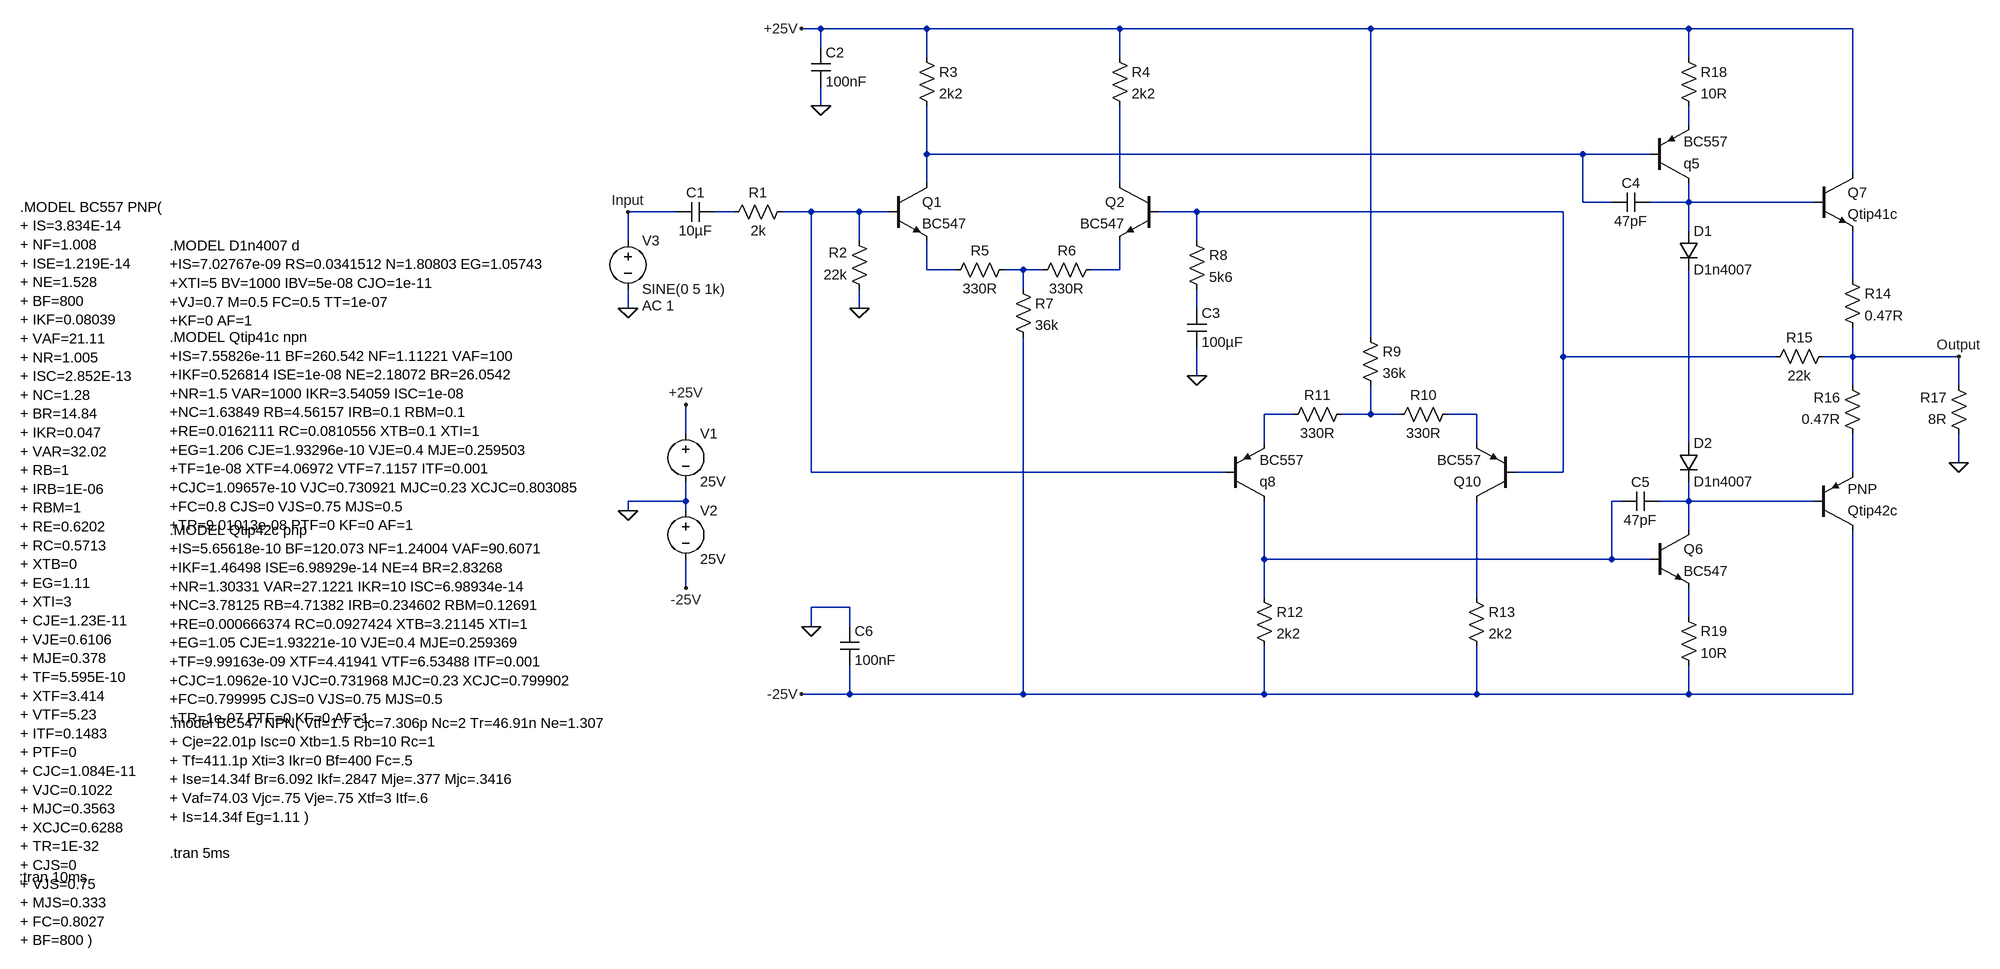
[diagram p0: schematic simulacao - AmplificadorAB.asc]
simulacao - AmplificadorAB.asc, the LTspice schematic file:
Version 4
SHEET 1 2872 1376
WIRE 192 -112 160 -112
WIRE 368 -112 192 -112
WIRE 688 -112 368 -112
WIRE 1104 -112 688 -112
WIRE 1632 -112 1104 -112
WIRE 1904 -112 1632 -112
WIRE 192 -80 192 -112
WIRE 368 -64 368 -112
WIRE 688 -64 688 -112
WIRE 1632 -64 1632 -112
WIRE 192 16 192 -16
WIRE 1632 48 1632 16
WIRE 368 96 368 16
WIRE 1456 96 368 96
WIRE 1568 96 1456 96
WIRE 1904 128 1904 -112
WIRE 368 144 368 96
WIRE 688 144 688 16
WIRE 1456 176 1456 96
WIRE 1504 176 1456 176
WIRE 1632 176 1632 144
WIRE 1632 176 1568 176
WIRE 1840 176 1632 176
WIRE -48 192 -128 192
WIRE 48 192 16 192
WIRE 176 192 128 192
WIRE 256 192 176 192
WIRE 304 192 256 192
WIRE 816 192 752 192
WIRE 1424 192 816 192
WIRE 1632 224 1632 176
WIRE -128 240 -128 192
WIRE 256 240 256 192
WIRE 816 240 816 192
WIRE 368 288 368 240
WIRE 416 288 368 288
WIRE 528 288 496 288
WIRE 560 288 528 288
WIRE 688 288 688 240
WIRE 688 288 640 288
WIRE 1904 304 1904 224
WIRE 528 320 528 288
WIRE -128 352 -128 320
WIRE 256 352 256 320
WIRE 816 352 816 320
WIRE 1104 400 1104 -112
WIRE 1424 432 1424 192
WIRE 1776 432 1424 432
WIRE 1904 432 1904 384
WIRE 1904 432 1856 432
WIRE 2080 432 1904 432
WIRE 816 464 816 416
WIRE 1904 480 1904 432
WIRE 2080 480 2080 432
WIRE 976 528 928 528
WIRE 1104 528 1104 480
WIRE 1104 528 1056 528
WIRE 1152 528 1104 528
WIRE 1280 528 1232 528
WIRE -32 560 -32 512
WIRE 928 576 928 528
WIRE 1280 576 1280 528
WIRE 1632 576 1632 288
WIRE 2080 608 2080 560
WIRE 176 624 176 192
WIRE 864 624 176 624
WIRE 1424 624 1424 432
WIRE 1424 624 1344 624
WIRE 1904 624 1904 560
WIRE -32 672 -32 640
WIRE -32 672 -128 672
WIRE 1520 672 1504 672
WIRE 1632 672 1632 640
WIRE 1632 672 1584 672
WIRE 1840 672 1632 672
WIRE -128 688 -128 672
WIRE -32 688 -32 672
WIRE 1632 720 1632 672
WIRE 928 768 928 672
WIRE 1504 768 1504 672
WIRE 1504 768 928 768
WIRE 1568 768 1504 768
WIRE -32 816 -32 768
WIRE 928 832 928 768
WIRE 1280 832 1280 672
WIRE 240 848 176 848
WIRE 1632 864 1632 816
WIRE 176 880 176 848
WIRE 240 880 240 848
WIRE 240 992 240 944
WIRE 240 992 160 992
WIRE 528 992 528 400
WIRE 528 992 240 992
WIRE 928 992 928 912
WIRE 928 992 528 992
WIRE 1280 992 1280 912
WIRE 1280 992 928 992
WIRE 1632 992 1632 944
WIRE 1632 992 1280 992
WIRE 1904 992 1904 720
WIRE 1904 992 1632 992
FLAG 256 352 0
FLAG 816 464 0
FLAG 2080 608 0
FLAG -128 688 0
FLAG -32 512 +25V
FLAG -32 816 -25V
FLAG 160 -112 +25V
FLAG 192 16 0
FLAG 160 992 -25V
FLAG -128 352 0
FLAG 176 880 0
FLAG 2080 432 Output
FLAG -128 192 Input
SYMBOL cap 16 176 R90
WINDOW 0 0 32 VBottom 2
WINDOW 3 32 32 VTop 2
SYMATTR InstName C1
SYMATTR Value 10µF
SYMBOL res 144 176 R90
WINDOW 0 0 56 VBottom 2
WINDOW 3 32 56 VTop 2
SYMATTR InstName R1
SYMATTR Value 2k
SYMBOL res 272 336 R180
WINDOW 0 36 76 Left 2
WINDOW 3 36 40 Left 2
SYMATTR InstName R2
SYMATTR Value 22k
SYMBOL cap 176 -80 R0
SYMATTR InstName C2
SYMATTR Value 100nF
SYMBOL res 352 -80 R0
SYMATTR InstName R3
SYMATTR Value 2k2
SYMBOL res 672 -80 R0
SYMATTR InstName R4
SYMATTR Value 2k2
SYMBOL res 512 272 R90
WINDOW 0 0 56 VBottom 2
WINDOW 3 32 56 VTop 2
SYMATTR InstName R5
SYMATTR Value 330R
SYMBOL res 656 272 R90
WINDOW 0 0 56 VBottom 2
WINDOW 3 32 56 VTop 2
SYMATTR InstName R6
SYMATTR Value 330R
SYMBOL res 512 304 R0
SYMATTR InstName R7
SYMATTR Value 36k
SYMBOL res 800 224 R0
SYMATTR InstName R8
SYMATTR Value 5k6
SYMBOL cap 800 352 R0
SYMATTR InstName C3
SYMATTR Value 100µF
SYMBOL npn 304 144 R0
SYMATTR InstName Q1
SYMATTR Value BC547
SYMBOL npn 752 144 M0
SYMATTR InstName Q2
SYMATTR Value BC547
SYMBOL pnp 864 672 M180
SYMATTR InstName q8
SYMATTR Value BC557
SYMBOL pnp 1344 672 R180
SYMATTR InstName Q10
SYMATTR Value BC557
SYMBOL res 1088 384 R0
SYMATTR InstName R9
SYMATTR Value 36k
SYMBOL res 1248 512 R90
WINDOW 0 0 56 VBottom 2
WINDOW 3 32 56 VTop 2
SYMATTR InstName R10
SYMATTR Value 330R
SYMBOL res 1072 512 R90
WINDOW 0 0 56 VBottom 2
WINDOW 3 32 56 VTop 2
SYMATTR InstName R11
SYMATTR Value 330R
SYMBOL res 912 816 R0
SYMATTR InstName R12
SYMATTR Value 2k2
SYMBOL res 1264 816 R0
SYMATTR InstName R13
SYMATTR Value 2k2
SYMBOL res 1888 288 R0
SYMATTR InstName R14
SYMATTR Value 0.47R
SYMATTR SpiceLine pwr=5W
SYMBOL res 1872 416 R90
WINDOW 0 0 56 VBottom 2
WINDOW 3 32 56 VTop 2
SYMATTR InstName R15
SYMATTR Value 22k
SYMBOL res 1920 576 R180
WINDOW 0 36 76 Left 2
WINDOW 3 36 40 Left 2
SYMATTR InstName R16
SYMATTR Value 0.47R
SYMATTR SpiceLine pwr=5W
SYMBOL res 2096 576 R180
WINDOW 0 36 76 Left 2
WINDOW 3 36 40 Left 2
SYMATTR InstName R17
SYMATTR Value 8R
SYMATTR SpiceLine pwr=50W
SYMBOL voltage -32 544 R0
WINDOW 123 0 0 Left 0
WINDOW 39 0 0 Left 0
SYMATTR InstName V1
SYMATTR Value 25V
SYMBOL voltage -32 672 R0
WINDOW 123 0 0 Left 0
WINDOW 39 0 0 Left 0
SYMATTR InstName V2
SYMATTR Value 25V
SYMBOL pnp 1568 144 M180
SYMATTR InstName q5
SYMATTR Value BC557
SYMBOL res 1616 -80 R0
SYMATTR InstName R18
SYMATTR Value 10R
SYMBOL cap 1568 160 R90
WINDOW 0 0 32 VBottom 2
WINDOW 3 32 32 VTop 2
SYMATTR InstName C4
SYMATTR Value 47pF
SYMBOL diode 1616 224 R0
SYMATTR InstName D1
SYMATTR Value D1n4007
SYMBOL npn 1568 720 R0
SYMATTR InstName Q6
SYMATTR Value BC547
SYMBOL diode 1616 576 R0
SYMATTR InstName D2
SYMATTR Value D1n4007
SYMBOL cap 1584 656 R90
WINDOW 0 0 32 VBottom 2
WINDOW 3 32 32 VTop 2
SYMATTR InstName C5
SYMATTR Value 47pF
SYMBOL res 1616 848 R0
SYMATTR InstName R19
SYMATTR Value 10R
SYMBOL npn 1840 128 R0
SYMATTR InstName Q7
SYMATTR Value Qtip41c
SYMBOL pnp 1840 720 M180
SYMATTR InstName Qtip42c
SYMBOL voltage -128 224 R0
WINDOW 123 24 124 Left 2
WINDOW 39 0 0 Left 0
SYMATTR Value2 AC 1
SYMATTR InstName V3
SYMATTR Value SINE(0 5 1k)
SYMBOL cap 224 880 R0
SYMATTR InstName C6
SYMATTR Value 100nF
TEXT -888 248 Left 2 !.MODEL D1n4007 d\n+IS=7.02767e-09 RS=0.0341512 N=1.80803 EG=1.05743\n+XTI=5 BV=1000 IBV=5e-08 CJO=1e-11\n+VJ=0.7 M=0.5 FC=0.5 TT=1e-07\n+KF=0 AF=1
TEXT -888 400 Left 2 !.MODEL Qtip41c npn\n+IS=7.55826e-11 BF=260.542 NF=1.11221 VAF=100\n+IKF=0.526814 ISE=1e-08 NE=2.18072 BR=26.0542\n+NR=1.5 VAR=1000 IKR=3.54059 ISC=1e-08\n+NC=1.63849 RB=4.56157 IRB=0.1 RBM=0.1\n+RE=0.0162111 RC=0.0810556 XTB=0.1 XTI=1\n+EG=1.206 CJE=1.93296e-10 VJE=0.4 MJE=0.259503\n+TF=1e-08 XTF=4.06972 VTF=7.1157 ITF=0.001\n+CJC=1.09657e-10 VJC=0.730921 MJC=0.23 XCJC=0.803085\n+FC=0.8 CJS=0 VJS=0.75 MJS=0.5\n+TR=9.01013e-08 PTF=0 KF=0 AF=1
TEXT -888 720 Left 2 !.MODEL Qtip42c pnp\n+IS=5.65618e-10 BF=120.073 NF=1.24004 VAF=90.6071\n+IKF=1.46498 ISE=6.98929e-14 NE=4 BR=2.83268\n+NR=1.30331 VAR=27.1221 IKR=10 ISC=6.98934e-14\n+NC=3.78125 RB=4.71382 IRB=0.234602 RBM=0.12691\n+RE=0.000666374 RC=0.0927424 XTB=3.21145 XTI=1\n+EG=1.05 CJE=1.93221e-10 VJE=0.4 MJE=0.259369\n+TF=9.99163e-09 XTF=4.41941 VTF=6.53488 ITF=0.001\n+CJC=1.0962e-10 VJC=0.731968 MJC=0.23 XCJC=0.799902\n+FC=0.799995 CJS=0 VJS=0.75 MJS=0.5\n+TR=1e-07 PTF=0 KF=0 AF=1
TEXT -888 1040 Left 2 !.model BC547 NPN( Vtf=1.7 Cjc=7.306p Nc=2 Tr=46.91n Ne=1.307 \n+ Cje=22.01p Isc=0 Xtb=1.5 Rb=10 Rc=1 \n+ Tf=411.1p Xti=3 Ikr=0 Bf=400 Fc=.5 \n+ Ise=14.34f Br=6.092 Ikf=.2847 Mje=.377 Mjc=.3416 \n+ Vaf=74.03 Vjc=.75 Vje=.75 Xtf=3 Itf=.6 \n+ Is=14.34f Eg=1.11 )
TEXT -1136 184 Left 2 !.MODEL BC557 PNP(\n+ IS=3.834E-14\n+ NF=1.008\n+ ISE=1.219E-14\n+ NE=1.528\n+ BF=800\n+ IKF=0.08039\n+ VAF=21.11\n+ NR=1.005\n+ ISC=2.852E-13\n+ NC=1.28\n+ BR=14.84\n+ IKR=0.047\n+ VAR=32.02\n+ RB=1\n+ IRB=1E-06\n+ RBM=1\n+ RE=0.6202\n+ RC=0.5713\n+ XTB=0\n+ EG=1.11\n+ XTI=3\n+ CJE=1.23E-11\n+ VJE=0.6106\n+ MJE=0.378\n+ TF=5.595E-10\n+ XTF=3.414\n+ VTF=5.23\n+ ITF=0.1483\n+ PTF=0\n+ CJC=1.084E-11\n+ VJC=0.1022\n+ MJC=0.3563\n+ XCJC=0.6288\n+ TR=1E-32\n+ CJS=0\n+ VJS=0.75\n+ MJS=0.333\n+ FC=0.8027\n+ BF=800 )
TEXT -888 1256 Left 2 !.tran 5ms
TEXT -1138 1296 Left 2 !;tran 10ms

The netlist it stands for:
* simulacao - AmplificadorAB.asc
C1 N005 Input 10µF
R1 N006 N005 2k
R2 0 N006 22k
C2 +25V 0 100nF
R3 +25V N002 2k2
R4 +25V N003 2k2
R5 N009 N008 330R
R6 N010 N009 330R
R7 N009 -25V 36k
R8 N007 N012 5k6
C3 N012 0 100µF
Q1 N002 N006 N008 0 BC547
Q2 N003 N007 N010 0 BC547
q8 N018 N006 N013 0 BC557
Q10 N020 N007 N015 0 BC557
R9 +25V N014 36k
R10 N015 N014 330R
R11 N014 N013 330R
R12 N018 -25V 2k2
R13 N020 -25V 2k2
R14 N011 Output 0.47R pwr=5W
R15 Output N007 22k
R16 N017 Output 0.47R pwr=5W
R17 0 Output 8R pwr=50W
V1 +25V 0 25V
V2 0 -25V 25V
q5 N004 N002 N001 0 BC557
R18 +25V N001 10R
C4 N004 N002 47pF
D1 N004 N016 D1n4007
Q6 N019 N018 N021 0 BC547
D2 N016 N019 D1n4007
C5 N019 N018 47pF
R19 N021 -25V 10R
Q7 +25V N004 N011 0 Qtip41c
Qtip42c -25V N019 N017 0 PNP
V3 Input 0 SINE(0 5 1k) AC 1
C6 0 -25V 100nF
.model D D
.lib standard.dio
.model NPN NPN
.model PNP PNP
.lib standard.bjt
.MODEL D1n4007 d
+IS=7.02767e-09 RS=0.0341512 N=1.80803 EG=1.05743
+XTI=5 BV=1000 IBV=5e-08 CJO=1e-11
+VJ=0.7 M=0.5 FC=0.5 TT=1e-07
+KF=0 AF=1
.MODEL Qtip41c npn
+IS=7.55826e-11 BF=260.542 NF=1.11221 VAF=100
+IKF=0.526814 ISE=1e-08 NE=2.18072 BR=26.0542
+NR=1.5 VAR=1000 IKR=3.54059 ISC=1e-08
+NC=1.63849 RB=4.56157 IRB=0.1 RBM=0.1
+RE=0.0162111 RC=0.0810556 XTB=0.1 XTI=1
+EG=1.206 CJE=1.93296e-10 VJE=0.4 MJE=0.259503
+TF=1e-08 XTF=4.06972 VTF=7.1157 ITF=0.001
+CJC=1.09657e-10 VJC=0.730921 MJC=0.23 XCJC=0.803085
+FC=0.8 CJS=0 VJS=0.75 MJS=0.5
+TR=9.01013e-08 PTF=0 KF=0 AF=1
.MODEL Qtip42c pnp
+IS=5.65618e-10 BF=120.073 NF=1.24004 VAF=90.6071
+IKF=1.46498 ISE=6.98929e-14 NE=4 BR=2.83268
+NR=1.30331 VAR=27.1221 IKR=10 ISC=6.98934e-14
+NC=3.78125 RB=4.71382 IRB=0.234602 RBM=0.12691
+RE=0.000666374 RC=0.0927424 XTB=3.21145 XTI=1
+EG=1.05 CJE=1.93221e-10 VJE=0.4 MJE=0.259369
+TF=9.99163e-09 XTF=4.41941 VTF=6.53488 ITF=0.001
+CJC=1.0962e-10 VJC=0.731968 MJC=0.23 XCJC=0.799902
+FC=0.799995 CJS=0 VJS=0.75 MJS=0.5
+TR=1e-07 PTF=0 KF=0 AF=1
.model BC547 NPN( Vtf=1.7 Cjc=7.306p Nc=2 Tr=46.91n Ne=1.307
+ Cje=22.01p Isc=0 Xtb=1.5 Rb=10 Rc=1
+ Tf=411.1p Xti=3 Ikr=0 Bf=400 Fc=.5
+ Ise=14.34f Br=6.092 Ikf=.2847 Mje=.377 Mjc=.3416
+ Vaf=74.03 Vjc=.75 Vje=.75 Xtf=3 Itf=.6
+ Is=14.34f Eg=1.11 )
.MODEL BC557 PNP(
+ IS=3.834E-14
+ NF=1.008
+ ISE=1.219E-14
+ NE=1.528
+ BF=800
+ IKF=0.08039
+ VAF=21.11
+ NR=1.005
+ ISC=2.852E-13
+ NC=1.28
+ BR=14.84
+ IKR=0.047
+ VAR=32.02
+ RB=1
+ IRB=1E-06
+ RBM=1
+ RE=0.6202
+ RC=0.5713
+ XTB=0
+ EG=1.11
+ XTI=3
+ CJE=1.23E-11
+ VJE=0.6106
+ MJE=0.378
+ TF=5.595E-10
+ XTF=3.414
+ VTF=5.23
+ ITF=0.1483
+ PTF=0
+ CJC=1.084E-11
+ VJC=0.1022
+ MJC=0.3563
+ XCJC=0.6288
+ TR=1E-32
+ CJS=0
+ VJS=0.75
+ MJS=0.333
+ FC=0.8027
+ BF=800 )
.tran 5ms
;tran 10ms
.backanno
.end